# Altium schematic sheet Bluetooth.SchDoc: Serial to Bluetooth module
size A4
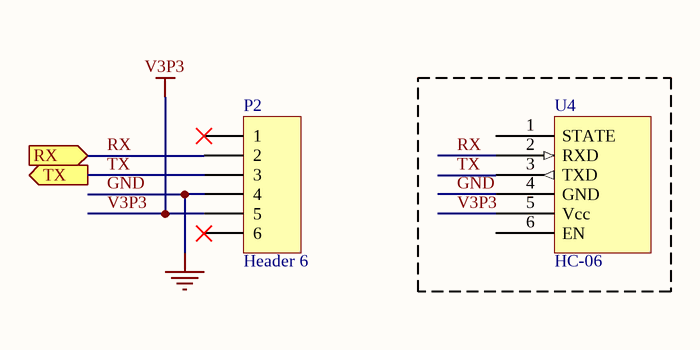
[diagram p0: Bluetooth.SchDoc]

## Parts
P2  Header 6  [Header 6]  (mechanical)
U4  HC-06

## Ports
RX (in), TX (out)

## Nets
GND: P2.4 U4.4(GND)
V3P3: P2.5 U4.5(Vcc)
RX: P2.2 U4.2(RXD) ; port RX
TX: P2.3 U4.3(TXD) ; port TX

Not connected (* = marked no-connect by the designer): P2 1* 6*; U4 1(STATE) 6(EN)

## Notes on the sheet
- Title
- Size:
- Date:
- A4
- Number:
- Time:
- Revision:
- Sheet
- of
- File:

## Library data of the parts
P2 = Header 6: Header, 6-Pin; Fabricant: MULTICOMP; Fournisseur: Farnell; RefFournisseur: 1593462; RefFabricant: 2212S-06SG-85
U4 = HC-06: Bluetooth; Fabricant: Wavesen; RefFabricant: HC-06